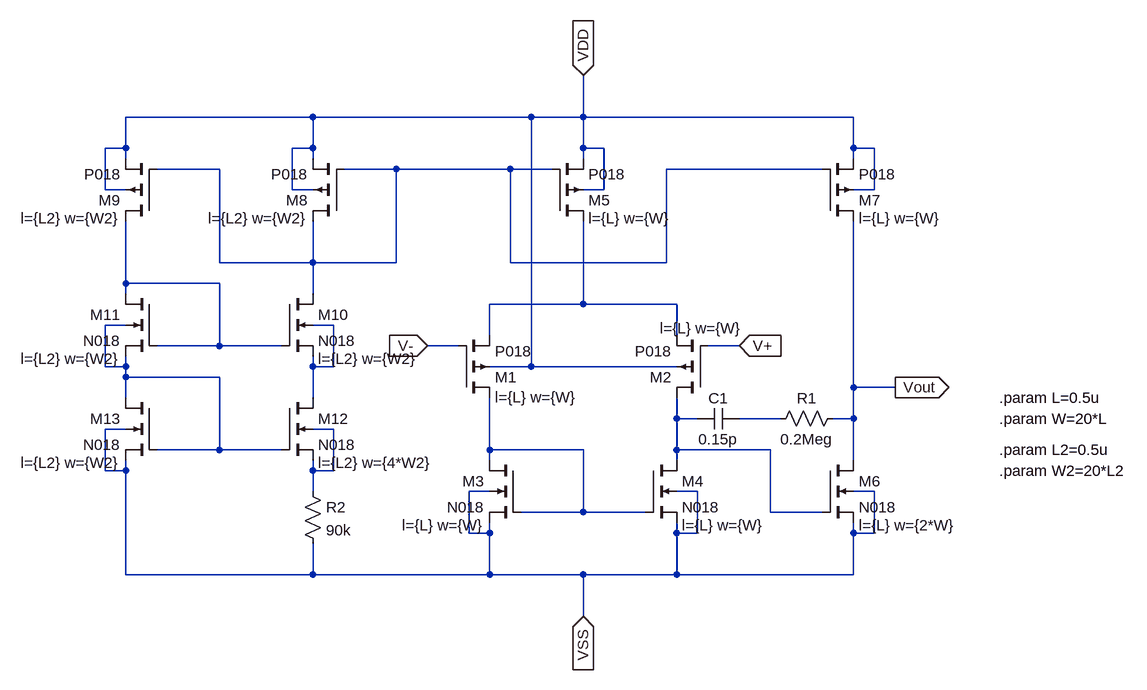
[diagram p0: schematic OpAmp_V1.asc]
OpAmp_V1.asc, the LTspice schematic file:
Version 4
SHEET 1 1276 776
WIRE -64 -96 -352 -96
WIRE 272 -96 -64 -96
WIRE 352 -96 352 -160
WIRE 352 -96 272 -96
WIRE 768 -96 352 -96
WIRE -352 -48 -352 -96
WIRE -352 -48 -384 -48
WIRE -64 -48 -64 -96
WIRE -64 -48 -96 -48
WIRE 352 -48 352 -96
WIRE 384 -48 352 -48
WIRE 768 -48 768 -96
WIRE 800 -48 768 -48
WIRE -352 -32 -352 -48
WIRE -64 -32 -64 -48
WIRE 352 -32 352 -48
WIRE 768 -32 768 -48
WIRE -208 -16 -304 -16
WIRE 64 -16 -16 -16
WIRE 240 -16 64 -16
WIRE 304 -16 240 -16
WIRE 720 -16 480 -16
WIRE -384 16 -384 -48
WIRE -352 16 -384 16
WIRE -96 16 -96 -48
WIRE -64 16 -96 16
WIRE 384 16 384 -48
WIRE 384 16 352 16
WIRE 800 16 800 -48
WIRE 800 16 768 16
WIRE -208 128 -208 -16
WIRE -64 128 -64 64
WIRE -64 128 -208 128
WIRE 64 128 64 -16
WIRE 64 128 -64 128
WIRE 240 128 240 -16
WIRE 480 128 480 -16
WIRE 480 128 240 128
WIRE -352 160 -352 64
WIRE -208 160 -352 160
WIRE -352 176 -352 160
WIRE -64 176 -64 128
WIRE 352 192 352 64
WIRE 352 192 208 192
WIRE 496 192 352 192
WIRE -352 224 -384 224
WIRE -32 224 -64 224
WIRE 208 240 208 192
WIRE 496 240 496 192
WIRE -208 256 -208 160
WIRE -208 256 -304 256
WIRE -112 256 -208 256
WIRE 160 256 112 256
WIRE 592 256 544 256
WIRE -384 288 -384 224
WIRE -352 288 -352 272
WIRE -352 288 -384 288
WIRE -64 288 -64 272
WIRE -32 288 -32 224
WIRE -32 288 -64 288
WIRE 272 288 272 -96
WIRE 272 288 208 288
WIRE 496 288 272 288
WIRE -352 304 -352 288
WIRE -208 304 -352 304
WIRE 768 320 768 64
WIRE 832 320 768 320
WIRE -352 336 -352 304
WIRE -64 336 -64 288
WIRE 496 368 496 336
WIRE 528 368 496 368
WIRE 656 368 592 368
WIRE 768 368 768 320
WIRE 768 368 736 368
WIRE -352 384 -384 384
WIRE -32 384 -64 384
WIRE -208 416 -208 304
WIRE -208 416 -304 416
WIRE -112 416 -208 416
WIRE 208 416 208 336
WIRE 352 416 208 416
WIRE 496 416 496 368
WIRE 640 416 496 416
WIRE 208 432 208 416
WIRE 496 432 496 416
WIRE 768 432 768 368
WIRE -384 448 -384 384
WIRE -352 448 -352 432
WIRE -352 448 -384 448
WIRE -64 448 -64 432
WIRE -32 448 -32 384
WIRE -32 448 -64 448
WIRE -64 480 -64 448
WIRE 208 480 176 480
WIRE 528 480 496 480
WIRE 800 480 768 480
WIRE 352 512 352 416
WIRE 352 512 256 512
WIRE 448 512 352 512
WIRE 640 512 640 416
WIRE 720 512 640 512
WIRE 176 544 176 480
WIRE 208 544 208 528
WIRE 208 544 176 544
WIRE 496 544 496 528
WIRE 528 544 528 480
WIRE 528 544 496 544
WIRE 768 544 768 528
WIRE 800 544 800 480
WIRE 800 544 768 544
WIRE -352 608 -352 448
WIRE -64 608 -64 560
WIRE -64 608 -352 608
WIRE 208 608 208 544
WIRE 208 608 -64 608
WIRE 352 608 208 608
WIRE 496 608 496 544
WIRE 496 608 352 608
WIRE 768 608 768 544
WIRE 768 608 496 608
WIRE 352 672 352 608
FLAG 352 -160 VDD
IOPIN 352 -160 In
FLAG 352 672 VSS
IOPIN 352 672 In
FLAG 112 256 V-
IOPIN 112 256 In
FLAG 592 256 V+
IOPIN 592 256 In
FLAG 832 320 Vout
IOPIN 832 320 Out
SYMBOL pmos4 -16 64 R180
WINDOW 123 56 4 Left 2
SYMATTR Value2 l={L2} w={W2}
SYMATTR InstName M8
SYMATTR Value P018
SYMBOL nmos4 256 432 M0
WINDOW 123 56 100 Left 2
SYMATTR Value2 l={L} w={W}
SYMATTR InstName M3
SYMATTR Value N018
SYMBOL cap 592 352 R90
WINDOW 0 0 32 VBottom 2
WINDOW 3 32 32 VTop 2
SYMATTR InstName C1
SYMATTR Value 0.15p
SYMBOL nmos4 448 432 R0
WINDOW 123 56 100 Left 2
SYMATTR Value2 l={L} w={W}
SYMATTR InstName M4
SYMATTR Value N018
SYMBOL nmos4 720 432 R0
WINDOW 123 56 100 Left 2
SYMATTR Value2 l={L} w={2*W}
SYMATTR InstName M6
SYMATTR Value N018
SYMBOL res 752 352 R90
WINDOW 0 0 56 VBottom 2
WINDOW 3 32 56 VTop 2
SYMATTR InstName R1
SYMATTR Value 0.2Meg
SYMBOL pmos4 304 64 M180
WINDOW 123 56 4 Left 2
SYMATTR Value2 l={L} w={W}
SYMATTR InstName M5
SYMATTR Value P018
SYMBOL pmos4 720 64 M180
WINDOW 123 56 4 Left 2
SYMATTR Value2 l={L} w={W}
SYMATTR InstName M7
SYMATTR Value P018
SYMBOL pmos4 160 336 M180
WINDOW 123 56 1 Left 2
SYMATTR Value2 l={L} w={W}
SYMATTR InstName M1
SYMATTR Value P018
SYMBOL pmos4 544 336 R180
WINDOW 123 -53 107 Left 2
SYMATTR Value2 l={L} w={W}
SYMATTR InstName M2
SYMATTR Value P018
SYMBOL nmos4 -112 176 R0
WINDOW 123 56 100 Left 2
SYMATTR Value2 l={L2} w={W2}
SYMATTR InstName M10
SYMATTR Value N018
SYMBOL nmos4 -112 336 R0
WINDOW 123 56 100 Left 2
SYMATTR Value2 l={L2} w={4*W2}
SYMATTR InstName M12
SYMATTR Value N018
SYMBOL nmos4 -304 176 M0
WINDOW 123 56 100 Left 2
SYMATTR Value2 l={L2} w={W2}
SYMATTR InstName M11
SYMATTR Value N018
SYMBOL pmos4 -304 64 R180
WINDOW 123 56 4 Left 2
SYMATTR Value2 l={L2} w={W2}
SYMATTR InstName M9
SYMATTR Value P018
SYMBOL res -80 464 R0
SYMATTR InstName R2
SYMATTR Value 90k
SYMBOL nmos4 -304 336 M0
WINDOW 123 56 100 Left 2
SYMATTR Value2 l={L2} w={W2}
SYMATTR InstName M13
SYMATTR Value N018
TEXT 992 336 Left 2 !.param L=0.5u
TEXT 992 368 Left 2 !.param W=20*L
TEXT 992 416 Left 2 !.param L2=0.5u
TEXT 992 448 Left 2 !.param W2=20*L2

The netlist it stands for:
* OpAmp_V1.asc
M8 N001 N001 VDD VDD P018 l={L2} w={W2}
M3 N009 N009 VSS VSS N018 l={L} w={W}
C1 N007 N006 0.15p
M4 N006 N009 VSS VSS N018 l={L} w={W}
M6 Vout N006 VSS VSS N018 l={L} w={2*W}
R1 Vout N007 0.2Meg
M5 N003 N001 VDD VDD P018 l={L} w={W}
M7 Vout N001 VDD VDD P018 l={L} w={W}
M1 N009 V- N003 VDD P018 l={L} w={W}
M2 N006 V+ N003 VDD P018 l={L} w={W}
M10 N001 N002 N005 N005 N018 l={L2} w={W2}
M12 N005 N004 N008 N008 N018 l={L2} w={4*W2}
M11 N002 N002 N004 N004 N018 l={L2} w={W2}
M9 N002 N001 VDD VDD P018 l={L2} w={W2}
R2 N008 VSS 90k
M13 N004 N004 VSS VSS N018 l={L2} w={W2}
.model NMOS NMOS
.model PMOS PMOS
.lib standard.mos
.param L=0.5u
.param W=20*L
.param L2=0.5u
.param W2=20*L2
.backanno
.end